# Altium schematic sheet DC_DC_boost.SchDoc
size A4; SheetNumber: 9; SheetTotal: 9
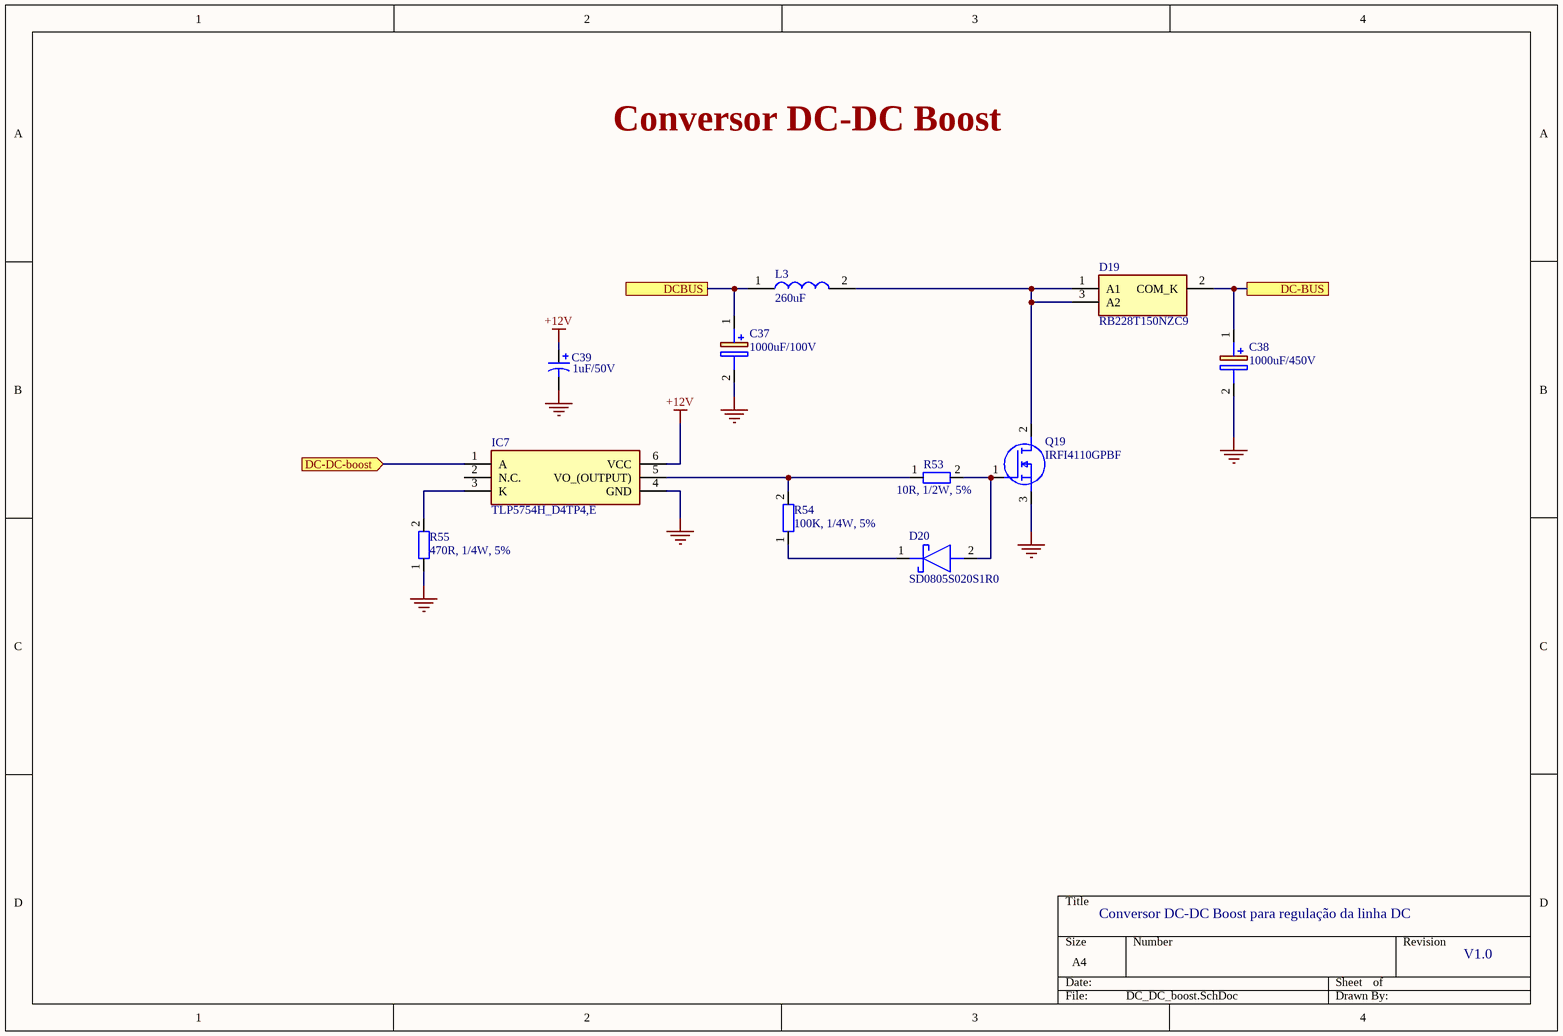
[diagram p0: DC_DC_boost.SchDoc]

## Parts
C37  1000uF/100V  [CAPPRD750W85D1800H3750]
C38  1000uF/450V  [CAPPRD1000W180D4000H8200]
C39  value 1uF/50V  [C1206]  (hidden comment: Cap Pol1)
D19  RB228T150NZC9  [TO254P480X1010X2100-3P]
D20  SD0805S020S1R0  [DIOM1613X100N]
IC7  TLP5754H_D4TP4,E  [SOIC127P1105X230-6N]
L3  260uF  [ATCA08251MV]
Q19  IRFI4110GPBF  [TO254P483X1018X2095-3P]
R53  10R, 1/2W, 5%  [RESC3216X60N]
R54  100K, 1/4W, 5%  [RES-0805]
R55  470R, 1/4W, 5%  [RES-0805]

## Ports
DC-BUS, DC-DC-boost (in), DCBUS

## Nets
+12V: C39.1 IC7.6(VCC)
GND: C37.2(-) C38.2(-) C39.2 IC7.4(GND) Q19.3(S) R55.1
DC-BUS: C38.1(+) D19.2(COM_K) ; port DC-BUS
DC-DC-boost: IC7.1(A) ; port DC-DC-boost
DCBUS: C37.1(+) L3.1 ; port DCBUS
NetD19_1: D19.1(A1) D19.3(A2) L3.2 Q19.2(D)
NetD20_1: D20.1(K) R54.1
NetD20_2: D20.2(A) Q19.1(G) R53.2
NetIC7_3: IC7.3(K) R55.2
NetIC7_5: IC7.5(VO_(OUTPUT)) R53.1 R54.2

Not connected (* = marked no-connect by the designer): IC7 2(N.C.)

## Notes on the sheet
- Conversor DC-DC Boost
- Conversor DC-DC Boost para regulação da linha DC
- V1.0

## Library data of the parts
C37 = ECA-2AHG102: Aluminum Electrolytic Capacitors - Leaded 1000uF 100V; Manufacturer_Name: Panasonic; Capacitance: 1mF; Tolerance: 20%; Ripple Current: 985mA; Leakage Current: 3uA; Life (Hours): 2000Hour; Dissipation Factor: 0.08%; Lead/Base Style: Straight; Lead Diameter: 0.8mm; Datasheet Link: http://www.mouser.com/ds/2/315/ABA0000C1215-1109177.pdf; Height: 37.5mm; Manufacturer_Part_Number: ECA-2AHG102; Mouser Part Number: 667-ECA-2AHG102; Mouser Price/Stock: https://www.mouser.co.uk/ProductDetail/Panasonic/ECA-2AHG102/?qs=rrcJgg%2Fw9KxYcZZHtVYgiQ%3D%3D; Arrow Part Number: ECA-2AHG102; Arrow Price/Stock: https://www.arrow.com/en/products/eca-2ahg102/panasonic; Supplier 1: Mouser; Supplier Part Number 1: 667-ECA-2AHG102; Manufacturer: Panasonic; Manufacturer Part Number: ECA-2AHG102; RoHS: Yes; Category: Aluminum Electrolytic Capacitors; Stock 1: 994; Pricing 1: 1=2.62000, 10=1.75000, 50=1.75000, 100=1.60000, 1000=1.07000, 10000=1.07000 (USD); Mount: Through Hole,PCB; Case/Package: Radial; Number of Pins: 2; Contact Plating: Tin; Min Operating Temperature: -55°C; Max Operating Temperature: 105°C; Termination: Radial; Voltage Rating: 100V; Packaging: Bulk; Package Quantity: 50; Voltage Rating (DC): 100V; Voltage: 100V; Series: NHG; Construction: RADIAL; Diameter: 18mm; Length: 35.5mm; Width: 18mm; Lead Pitch: 7.5mm; Height - Seated (Max): 1.476inch; Radiation Hardening: No; REACH SVHC: No SVHC; Lead Free: Lead Free; RoHS Compliant: Yes; ComponentLink1URL: https://datasheet.ciiva.com/2984/aba0000ce26-2984390.pdf?src-supplier=Avnet; ComponentLink1Description: https://datasheet.ciiva.com/2984/aba0000ce26-2984390.pdf?src-supplier=Avnet; ComponentLink2URL: https://datasheet.ciiva.com/43459/1790596-43459676.pdf?src-supplier=Farnell; ComponentLink2Description: https://datasheet.ciiva.com/43459/1790596-43459676.pdf?src-supplier=Farnell; ComponentLink3URL: https://datasheet.ciiva.com/24027/aba0000ce26-372437-24027279.pdf?src-supplier=Mouser; ComponentLink3Description: https://datasheet.ciiva.com/24027/aba0000ce26-372437-24027279.pdf?src-supplier=Mouser; ComponentLink4URL: https://datasheet.ciiva.com/30158/8aba0000ce26-30158524.pdf?src-supplier=Onlinecomponents.com; ComponentLink4Description: https://datasheet.ciiva.com/30158/8aba0000ce26-30158524.pdf?src-supplier=Onlinecomponents.com; ComponentLink5URL: https://datasheet.ciiva.com/16387/aba0000ce26-16387053.pdf?src-supplier=Future+Electronics; ComponentLink5Description: https://datasheet.ciiva.com/16387/aba0000ce26-16387053.pdf?src-supplier=Future+Electronics; ComponentLink6URL: https://datasheet.ciiva.com/14594/70067776-14594090.pdf?src-supplier=Allied+Electronics; ComponentLink6Description: https://datasheet.ciiva.com/14594/70067776-14594090.pdf?src-supplier=Allied+Electronics; ComponentLink7URL: https://datasheet.ciiva.com/15198/getdatasheetpartid-470872-15198006.pdf?src-supplier=Verical; ComponentLink7Description: https://datasheet.ciiva.com/15198/getdatasheetpartid-470872-15198006.pdf?src-supplier=Verical; ComponentLink8URL: https://datasheet.ciiva.com/17533/aba0000ce26-17533421.pdf?src-supplier=Avnet+Europe; ComponentLink8Description: https://datasheet.ciiva.com/17533/aba0000ce26-17533421.pdf?src-supplier=Avnet+Europe; ComponentLink9URL: https://datasheet.ciiva.com/29248/792491-da-01-en-elko-nhg-r-1000uf-100v-105c-29248620.pdf?src-supplier=Conrad; ComponentLink9Description: https://datasheet.ciiva.com/29248/792491-da-01-en-elko-nhg-r-1000uf-100v-105c-29248620.pdf?src-supplier=Conrad
C38 = ALC10A102EL450: CAP ALUM 1000UF 20% 450V SNAP; Manufacturer_Name: Kemet; Dielectric Material: Aluminium; Capacitance: 1mF; Ripple Current: 4.95A; ESR (Equivalent Series Resistance): 114mR; Impedance: 75mR; Leakage Current: 2.7mA; Life (Hours): 18000Hour; Polarity: Polar; Lead Diameter: 2mm; Lead Length: 6.3mm; Datasheet Link: https://content.kemet.com/datasheets/KEM_A4020_ALC10.pdf; Height: 82mm; Manufacturer_Part_Number: ALC10A102EL450; Mouser Part Number: 80-ALC10A102EL450; Mouser Price/Stock: https://www.mouser.com/Search/Refine.aspx?Keyword=80-ALC10A102EL450; Arrow Part Number: ALC10A102EL450; Arrow Price/Stock: https://www.arrow.com/en/products/alc10a102el450/kemet-corporation; Supplier 1: Mouser; Supplier Part Number 1: 80-ALC10A102EL450; Manufacturer: KEMET; Manufacturer Part Number: ALC10A102EL450; RoHS: Yes; Category: Aluminum Electrolytic Capacitors; Stock 1: 305; Pricing 1: 1=19.57000, 10=18.30000, 50=15.79000, 100=14.80000, 1000=13.12000, 10000=13.12000 (USD); Mount: Through Hole,PCB; Case/Package: Radial; Min Operating Temperature: -40°C; Max Operating Temperature: 85°C; Package Quantity: 36; Voltage Rating: 450V; Tolerance: 20%; Packaging: Bulk; Voltage Rating (DC): 450V; Termination: Snap in; Voltage: 450V; Series: ALC10; Diameter: 40mm; Length: 80mm; Lead Pitch: 0.394inch; Height - Seated (Max): 3.228inch; RoHS Compliant: Yes; ComponentLink1URL: https://datasheet.ciiva.com/101/kem-a4020-alc10-101348.pdf?src-supplier=Digi-Key; ComponentLink1Description: https://datasheet.ciiva.com/101/kem-a4020-alc10-101348.pdf?src-supplier=Digi-Key; ComponentLink2URL: https://datasheet.ciiva.com/5368/kem-a4020-alc10-535355-5368389.pdf?src-supplier=Mouser; ComponentLink2Description: https://datasheet.ciiva.com/5368/kem-a4020-alc10-535355-5368389.pdf?src-supplier=Mouser; ComponentLink3URL: https://datasheet.ciiva.com/14588/70096552-14588427.pdf?src-supplier=Allied+Electronics; ComponentLink3Description: https://datasheet.ciiva.com/14588/70096552-14588427.pdf?src-supplier=Allied+Electronics
C39 = Cap Pol1: KEMET         T491A105K050AT            Surface Mount Tantalum Capacitor, T491 Series, 1 F,  10%, 50 V, 1206 [3216 Metric], A; Capacitance: 1uF; ESR (Equivalent Series Resistance): 7R; Voltage Rating: 50V; Polarity: Polar; Dissipation Factor: 4%; Published: 8-Jun-2000; LatestRevisionDate: 17-Jul-2002; LatestRevisionNote: Re-released for DXP Platform.; PackageReference: RB7.6-15; Publisher: Altium Limited; PackageDescription: Polarized Capacitor (Radial); 2 Leads; Supplier 1: Mouser; Supplier Part Number 1: 80-T491A105K050AT; Manufacturer: KEMET; Manufacturer Part Number: T491A105K050AT; RoHS: Yes; Category: Tantalum Capacitors; Stock 1: 5526; Pricing 1: 1=0.86000, 10=0.53600, 50=0.53600, 100=0.37800, 1000=0.31600, 10000=0.24700 (USD); Case/Package: Molded; Case Code (Metric): 3216; Case Code (Imperial): 1206; Min Operating Temperature: -55°C; Max Operating Temperature: 125°C; Tolerance: 10%; Packaging: Cut Tape; Voltage Rating (DC): 50V; Length: 3.2mm; Depth: 1.6mm; REACH SVHC: No SVHC; Lead Free: Lead Free; RoHS Compliant: Yes; ComponentLink1URL: https://datasheet.ciiva.com/7972/1854511-7972911.pdf?src-supplier=Element14; ComponentLink1Description: https://datasheet.ciiva.com/7972/1854511-7972911.pdf?src-supplier=Element14
D19 = RB228T150NZC9: Schottky Diode; Manufacturer_Name: ROHM Semiconductor; Manufacturer: Rohm; Datasheet Link: https://fscdn.rohm.com/en/products/databook/datasheet/discrete/diode/schottky_barrier/rb228t150nz-e.pdf; Height: 4.8mm; Manufacturer_Part_Number: RB228T150NZC9; Supplier 1: Mouser; Supplier Part Number 1: 755-RB228T150NZC9; Manufacturer Part Number: RB228T150NZC9; RoHS: Yes; Stock 1: 982; Pricing 1: 1=1.74000, 10=1.48000, 50=1.48000, 100=1.14000, 1000=0.82400, 10000=0.78200 (USD)
D20 = SD0805S020S1R0: Schottky Diodes & Rectifiers 20volts 1A SIZE 0805; Manufacturer_Name: AVX; Manufacturer: Kyocera AVX; Max Surge Current: 10A; Forward Voltage: 450mV; Max Reverse Current: 200uA; Max Repetitive Reverse Voltage (Vrrm): 20V; Element Configuration: Single; Datasheet Link: https://componentsearchengine.com/Datasheets/1/SD0805S020S1R0.pdf; Height: 1mm; Manufacturer_Part_Number: SD0805S020S1R0; Mouser Part Number: 581-SD0805S020S1R0; Mouser Price/Stock: https://www.mouser.co.uk/ProductDetail/AVX/SD0805S020S1R0/?qs=jCA%252BPfw4LHbpkAoSnwrdjw%3D%3D; Arrow Part Number: SD0805S020S1R0; Arrow Price/Stock: https://www.arrow.com/en/products/sd0805s020s1r0/avx; Supplier 1: Mouser; Supplier Part Number 1: 581-SD0805S020S1R0; Manufacturer Part Number: SD0805S020S1R0; RoHS: Yes; Category: Rectifier Diodes; Stock 1: 14821; Pricing 1: 1=0.38000, 10=0.29100, 50=0.29100, 100=0.17800, 1000=0.11300, 10000=0.08700 (USD); Mount: Surface Mount; Case/Package: 0805; Number of Pins: 2; Case Code (Metric): 2012; Case Code (Imperial): 0805; Min Operating Temperature: -55°C; Max Operating Temperature: 125°C; Packaging: Tape and Reel; Package Quantity: 3000; Forward Current: 1A; Average Rectified Current: 1A; Max Reverse Leakage Current: 200uA; Max Forward Surge Current (Ifsm): 10A; Peak Non-Repetitive Surge Current: 10A; Max Reverse Voltage (DC): 20V; Series: -; Radiation Hardening: No; REACH SVHC: No SVHC; RoHS Compliant: Yes; ComponentLink1URL: https://datasheet.ciiva.com/29883/schottky-29883740.pdf?src-supplier=Avnet; ComponentLink1Description: https://datasheet.ciiva.com/29883/schottky-29883740.pdf?src-supplier=Avnet; ComponentLink2URL: https://datasheet.ciiva.com/29883/schottky-29883741.pdf?src-supplier=Avnet; ComponentLink2Description: https://datasheet.ciiva.com/29883/schottky-29883741.pdf?src-supplier=Avnet; ComponentLink3URL: https://datasheet.ciiva.com/13084/schottky-221155-13084174.pdf?src-supplier=Mouser; ComponentLink3Description: https://datasheet.ciiva.com/13084/schottky-221155-13084174.pdf?src-supplier=Mouser
IC7 = TLP5754H_D4TP4,E: Integrated Circuit; Manufacturer_Name: Toshiba; Manufacturer_Part_Number: TLP5754H(D4TP4,E; Datasheet Link: https://toshiba.semicon-storage.com/; Height: 2.3mm; Mouser Part Number: 757-TLP5754HD4TP4E; Mouser Price/Stock: https://www.mouser.co.uk/ProductDetail/Toshiba/TLP5754HD4TP4E?qs=BJlw7L4Cy78tX5u9MwNqOg%3D%3D; Supplier 1: Mouser; Supplier Part Number 1: 757-TLP5754HD4TP4E; Manufacturer: Toshiba; Manufacturer Part Number: TLP5754H(D4TP4,E; RoHS: Yes; Stock 1: 2749; Pricing 1: 1=2.13000, 10=1.86000, 50=1.83000, 100=1.09000, 1000=0.95600, 10000=0.73200 (USD)
L3 = ATCA-08-251M-V: Inductor Power Unshielded Toroid 250uH 20% Powdered Iron 10A 0.027Ohm DCR RDL Tray; Manufacturer_Name: ABRACON; DC Resistance (DCR): 27mR; Datasheet Link: https://componentsearchengine.com/Datasheets/2/ATCA-08-251M-V.pdf; Height: 42.5mm; Manufacturer_Part_Number: ATCA-08-251M-V; Mouser Part Number: 815-ATCA-08-251M-V; Mouser Price/Stock: https://www.mouser.co.uk/ProductDetail/ABRACON/ATCA-08-251M-V/?qs=AvgxZrxb8y1V5MUvgxkQSA%3D%3D; Arrow Part Number: ATCA-08-251M-V; Arrow Price/Stock: https://www.arrow.com/en/products/atca-08-251m-v/abracon; Supplier 1: Mouser; Supplier Part Number 1: 815-ATCA-08-251M-V; Manufacturer: Abracon; Manufacturer Part Number: ATCA-08-251M-V; RoHS: Yes; Category: Fixed Inductors; Stock 1: 1858; Pricing 1: 1=9.29000, 10=8.35000, 50=7.47000, 100=5.94000, 1000=5.57000, 10000=5.57000 (USD); Case/Package: Radial; Inductance: 250uH; RMS Current (Irms): 10A; Inductance Tolerance: 20%; REACH SVHC: No SVHC; RoHS Compliant: Yes; ComponentLink1URL: https://abracon.com//Magnetics/high-power-toroids/ATCA-08_packagedrawing.pdf?src-supplier=Digi-Key; ComponentLink1Description: https://abracon.com//Magnetics/high-power-toroids/ATCA-08_packagedrawing.pdf?src-supplier=Digi-Key; ComponentLink2URL: http://www.farnell.com/datasheets/2156230.pdf?src-supplier=Element14; ComponentLink2Description: http://www.farnell.com/datasheets/2156230.pdf?src-supplier=Element14
Q19 = IRFI4110GPBF: MOSFET N-CH 100V 72A TO220AB; Manufacturer_Name: Infineon; Rds On Max: 4.5mR; Input Capacitance: 9.54nF; Max Power Dissipation: 61W; Threshold Voltage: 4V; Datasheet Link: https://www.mouser.co.uk/datasheet/2/196/Infineon-IRFI4110G-DS-v01_02-EN-1227339.pdf; Height: 4.83mm; Manufacturer_Part_Number: IRFI4110GPBF; Mouser Part Number: 942-IRFI4110GPBF; Mouser Price/Stock: https://www.mouser.com/Search/Refine.aspx?Keyword=942-IRFI4110GPBF; Arrow Part Number: IRFI4110GPBF; Arrow Price/Stock: https://www.arrow.com/en/products/irfi4110gpbf/infineon-technologies-ag; Supplier 1: Mouser; Supplier Part Number 1: 942-IRFI4110GPBF; Manufacturer: Infineon; Manufacturer Part Number: IRFI4110GPBF; RoHS: Yes; Category: MOSFETs; Stock 1: 2175; Pricing 1: 1=3.400000, 10=2.890000, 100=2.310000, 500=2.060000, 1000=1.840000, 2000=1.840000 (USD); Mount: Through Hole; Case/Package: TO-220-3; Number of Pins: 3; Min Operating Temperature: -55°C; Max Operating Temperature: 175°C; Continuous Drain Current (ID): 72A; Packaging: Rail/Tube; Drain to Source Voltage (Vdss): 100V; Max Dual Supply Voltage: 100V; REACH SVHC: No SVHC; Lead Free: Lead Free; RoHS Compliant: Yes; Halogen Free: Halogen Free; ComponentLink1URL: http://www.infineon.com/dgdl/irfi4110gpbf.pdf?fileId=5546d462533600a401535623f28d1f78&src-supplier=Digi-Key; ComponentLink1Description: http://www.infineon.com/dgdl/irfi4110gpbf.pdf?fileId=5546d462533600a401535623f28d1f78&src-supplier=Digi-Key; ComponentLink2URL: http://www.farnell.com/datasheets/1302157.pdf?src-supplier=Element14; ComponentLink2Description: http://www.farnell.com/datasheets/1302157.pdf?src-supplier=Element14
R53 = RES-1206: Res Thick Film 0805 10 Ohm 5% 0.5W(1/2W) +/-200ppm/C Pad SMD Automotive T/R; Manufacturer: Vishay Dale; Manufacturer Part Number: CRCW080510R0JNEAHP; Temperature Coefficient: 200ppm/°C; Power Rating: 330mW; Voltage Rating: 150V; Max Power Dissipation: 333mW; Supplier 1: Mouser; Supplier Part Number 1: 71-CRCW080510R0JNEAH; RoHS: Yes; Category: Chip SMD Resistors; Stock 1: 4777; Pricing 1: 1=0.23000, 10=0.20300, 50=0.20300, 100=0.07900, 1000=0.03000, 10000=0.02700 (USD); Mount: Surface Mount; Case/Package: 0805; Contact Plating: Tin; Weight: 0.000194oz; Case Code (Metric): 2012; Case Code (Imperial): 0805; Min Operating Temperature: -55°C; Max Operating Temperature: 155°C; Resistance: 10R; Tolerance: 5%; Resistor Type: Thick Film; Packaging: Tape and Reel; Package Quantity: 1; Number of Terminations: 2; Features: Automotive AEC-Q200; Series: CRCW-HP; Construction: Rectangular; Length: 2mm; Width: 0.049inch; Height: 0.024inch; Depth: 1.25mm; Radiation Hardening: No; Military Standard: Not; Lead Free: Lead Free; RoHS Compliant: Yes; ComponentLink1URL: https://datasheet.ciiva.com/2499/crcwhpe3-2499490.pdf?src-supplier=Digi-Key; ComponentLink1Description: https://datasheet.ciiva.com/2499/crcwhpe3-2499490.pdf?src-supplier=Digi-Key; ComponentLink2URL: https://datasheet.ciiva.com/2499/crcwhpe3-2499491.pdf?src-supplier=Digi-Key; ComponentLink2Description: https://datasheet.ciiva.com/2499/crcwhpe3-2499491.pdf?src-supplier=Digi-Key; ComponentLink3URL: https://datasheet.ciiva.com/2499/crcwhpe3-2499492.pdf?src-supplier=Digi-Key; ComponentLink3Description: https://datasheet.ciiva.com/2499/crcwhpe3-2499492.pdf?src-supplier=Digi-Key; ComponentLink4URL: https://datasheet.ciiva.com/5562/crcwhpe3-46056-5562181.pdf?src-supplier=Mouser; ComponentLink4Description: https://datasheet.ciiva.com/5562/crcwhpe3-46056-5562181.pdf?src-supplier=Mouser; ComponentLink5URL: https://datasheet.ciiva.com/9050/crcwhpe3-9050566.pdf?src-supplier=Avnet; ComponentLink5Description: https://datasheet.ciiva.com/9050/crcwhpe3-9050566.pdf?src-supplier=Avnet
R54 = Res-0805: Thick Film Resistors 100K OHM 1%; Manufacturer_Name: YAGEO (PHYCOMP); Manufacturer_Part_Number: RC0805JR-131KL; Manufacturer: Yageo; Manufacturer Part Number: RC0805FR-13100KL; Resistance: 100kR; Temperature Coefficient: 100ppm/°C; Power Rating: 125mW; Voltage Rating: 150V; Datasheet Link: http://www.yageo.com/documents/recent/PYu-RC_Group_51_RoHS_L_10.pdf; Height: 0.6mm; Mouser Part Number: 603-RC0805JR-131KL; Mouser Price/Stock: https://www.mouser.com/Search/Refine.aspx?Keyword=603-RC0805JR-131KL; Supplier 1: Mouser; Supplier Part Number 1: 603-RC0805FR-13100KL; RoHS: Yes; Category: Chip SMD Resistors; Stock 1: 57591; Pricing 1: 1=0.13000, 10=0.03100, 50=0.03100, 100=0.01100, 1000=0.00800, 10000=0.00500 (USD); Case/Package: 0805; Contact Plating: Tin,Lead,Matte; Case Code (Imperial): 0805; Case Code (Metric): 2012; Size Code: 0805; Min Operating Temperature: -55°C; Max Operating Temperature: 155°C; Tolerance: 1%; Resistor Type: Thick Film; Packaging: Tape and Reel; Termination: SMD/SMT; Series: RC; Radiation Hardening: No; Lead Free: Lead Free; RoHS Compliant: Yes; ComponentLink1URL: https://datasheet.ciiva.com/5558/rc0805-5558047.pdf?src-supplier=Mouser; ComponentLink1Description: https://datasheet.ciiva.com/5558/rc0805-5558047.pdf?src-supplier=Mouser
R55 = Res-0805: Thick Film Resistors - SMD 470 OHM 5%; Manufacturer_Name: YAGEO (PHYCOMP); Manufacturer_Part_Number: RC0805JR-131KL; Manufacturer: Yageo; Manufacturer Part Number: RC0805JR-13470RL; Temperature Coefficient: 100ppm/°C; Power Rating: 125mW; Voltage Rating: 150V; Datasheet Link: http://www.yageo.com/documents/recent/PYu-RC_Group_51_RoHS_L_10.pdf; Height: 0.6mm; Mouser Part Number: 603-RC0805JR-131KL; Mouser Price/Stock: https://www.mouser.com/Search/Refine.aspx?Keyword=603-RC0805JR-131KL; Supplier 1: Mouser; Supplier Part Number 1: 603-RC0805JR-13470RL; RoHS: Yes; Category: Chip SMD Resistors; Stock 1: 48513; Pricing 1: 1=0.12000, 10=0.01700, 50=0.01700, 100=0.00600, 1000=0.00500, 10000=0.00400 (USD); Case/Package: 0805; Contact Plating: Tin,Matte; Case Code (Imperial): 0805; Case Code (Metric): 2012; Min Operating Temperature: -55°C; Max Operating Temperature: 155°C; Resistance: 470R; Tolerance: 5%; Resistor Type: Thick Film; Packaging: Tape and Reel; Termination: SMD/SMT; Series: RC; Construction: Rectangular; Length: 2mm; Width: 1.25mm; Depth: 1.25mm; Radiation Hardening: No; Military Standard: Not; RoHS Compliant: Yes; ComponentLink1URL: http://www.mouser.com/ds/2/447/Yageo_08112016_RC0805-968729.pdf?src-supplier=Mouser; ComponentLink1Description: http://www.mouser.com/ds/2/447/Yageo_08112016_RC0805-968729.pdf?src-supplier=Mouser; ComponentLink2URL: http://components.arrow.com/part/dataview/0323_04018308?src-supplier=Arrow+Europe; ComponentLink2Description: http://components.arrow.com/part/dataview/0323_04018308?src-supplier=Arrow+Europe; ComponentLink3URL: http://www.yageo.com/documents/recent/PYu-RC0805_51_RoHS_L-(4).pdf?src-supplier=Avnet+Europe; ComponentLink3Description: http://www.yageo.com/documents/recent/PYu-RC0805_51_RoHS_L-(4).pdf?src-supplier=Avnet+Europe